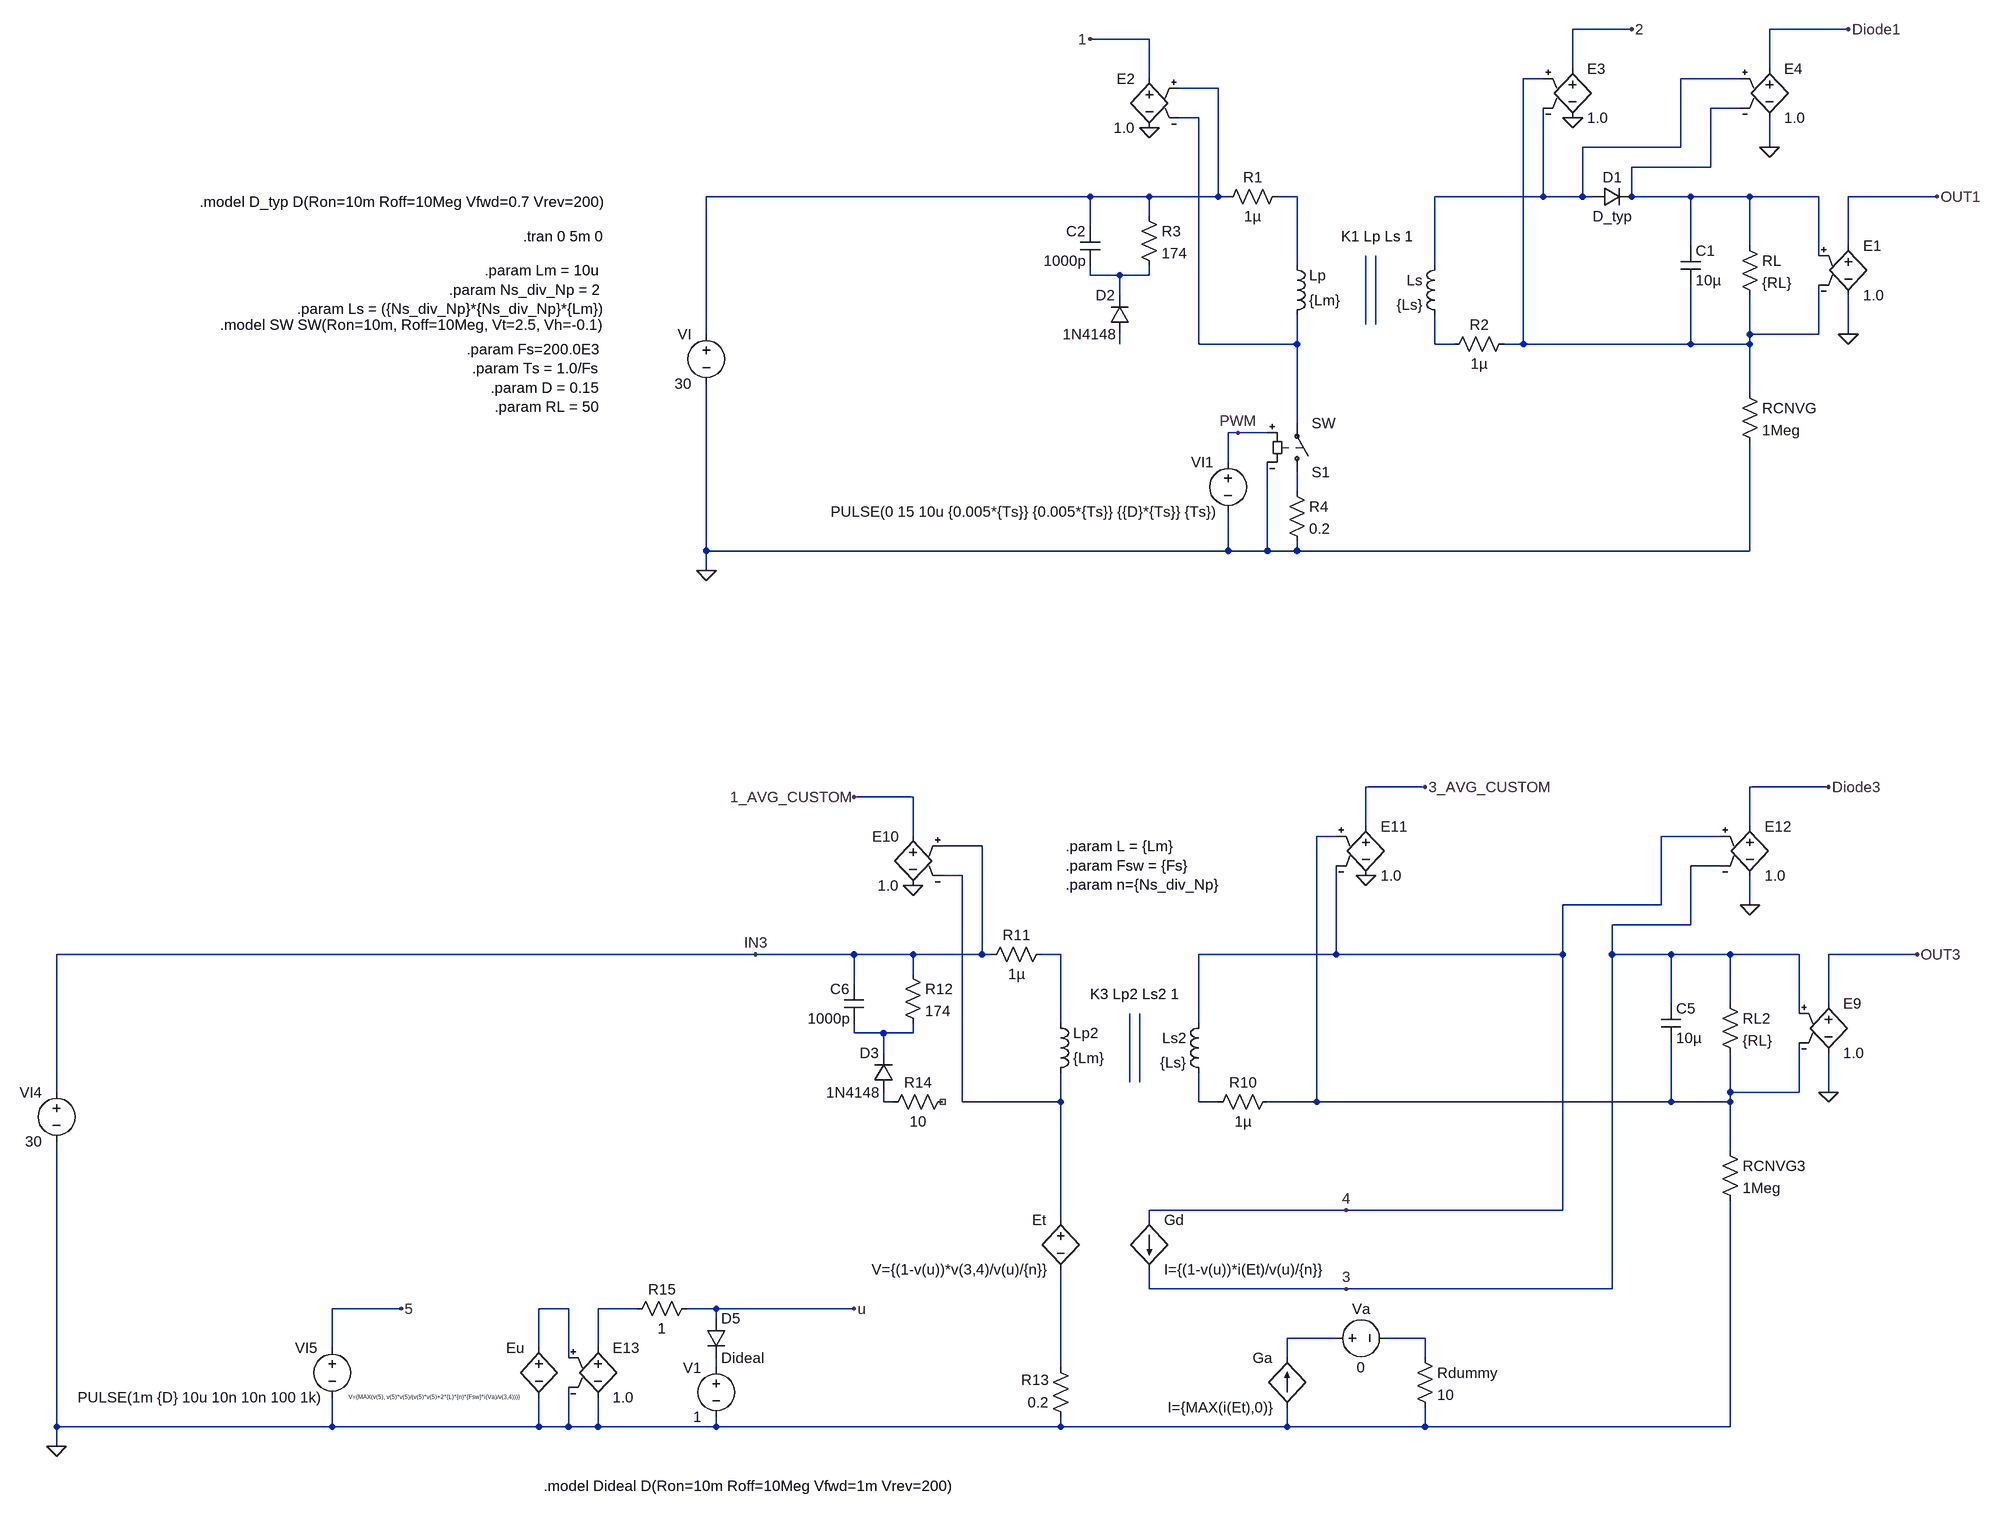
[diagram p0: schematic Flyback_Basic_Model_COPEC_Avgd_PWM_Switch_Diode.asc]
Flyback_Basic_Model_COPEC_Avgd_PWM_Switch_Diode.asc, the LTspice schematic file:
Version 4.1
SHEET 1 1712 3524
WIRE 624 -288 528 -288
WIRE 976 -288 848 -288
WIRE -160 -272 -256 -272
WIRE 528 -224 528 -288
WIRE 848 -224 848 -288
WIRE -160 -208 -160 -272
WIRE 480 -208 448 -208
WIRE 800 -208 704 -208
WIRE -48 -192 -112 -192
WIRE 800 -160 752 -160
WIRE -80 -144 -112 -144
WIRE 704 -96 704 -208
WIRE 704 -96 544 -96
WIRE 848 -96 848 -144
WIRE 752 -64 752 -160
WIRE 752 -64 624 -64
WIRE -256 -16 -880 -16
WIRE -160 -16 -256 -16
WIRE -48 -16 -48 -192
WIRE -48 -16 -160 -16
WIRE -32 -16 -48 -16
WIRE 80 -16 48 -16
WIRE 480 -16 480 -160
WIRE 480 -16 304 -16
WIRE 544 -16 544 -96
WIRE 544 -16 480 -16
WIRE 560 -16 544 -16
WIRE 624 -16 624 -64
WIRE 720 -16 624 -16
WIRE 816 -16 720 -16
WIRE 928 -16 816 -16
WIRE 1120 -16 976 -16
WIRE -160 16 -160 -16
WIRE -256 32 -256 -16
WIRE 720 64 720 -16
WIRE 816 64 816 -16
WIRE 976 64 976 -16
WIRE 928 80 928 -16
WIRE 80 96 80 -16
WIRE 304 96 304 -16
WIRE -256 112 -256 96
WIRE -208 112 -256 112
WIRE -160 112 -160 96
WIRE -160 112 -208 112
WIRE -208 144 -208 112
WIRE -880 208 -880 -16
WIRE 816 208 816 144
WIRE 928 208 928 128
WIRE 928 208 816 208
WIRE 976 208 976 144
WIRE -208 224 -208 208
WIRE -80 224 -80 -144
WIRE 80 224 80 176
WIRE 80 224 -80 224
WIRE 304 224 304 176
WIRE 336 224 304 224
WIRE 448 224 448 -208
WIRE 448 224 416 224
WIRE 720 224 720 128
WIRE 720 224 448 224
WIRE 816 224 816 208
WIRE 816 224 720 224
WIRE 816 304 816 224
WIRE 80 352 80 224
WIRE -16 368 -32 368
WIRE 32 368 -16 368
WIRE -32 416 -32 368
WIRE 80 464 80 432
WIRE -880 560 -880 288
WIRE -32 560 -32 496
WIRE -32 560 -880 560
WIRE 32 560 32 416
WIRE 32 560 -32 560
WIRE 80 560 80 544
WIRE 80 560 32 560
WIRE 816 560 816 384
WIRE 816 560 80 560
WIRE -880 592 -880 560
WIRE 288 944 192 944
WIRE 944 944 816 944
WIRE -544 960 -640 960
WIRE 192 1008 192 944
WIRE 816 1008 816 944
WIRE -544 1024 -544 960
WIRE 144 1024 112 1024
WIRE 768 1024 672 1024
WIRE -432 1040 -496 1040
WIRE 768 1072 720 1072
WIRE -464 1088 -496 1088
WIRE 672 1136 672 1024
WIRE 672 1136 512 1136
WIRE 816 1136 816 1088
WIRE 720 1168 720 1072
WIRE 720 1168 592 1168
WIRE -800 1216 -1936 1216
WIRE -640 1216 -800 1216
WIRE -544 1216 -640 1216
WIRE -432 1216 -432 1040
WIRE -432 1216 -544 1216
WIRE -416 1216 -432 1216
WIRE -304 1216 -336 1216
WIRE 144 1216 144 1072
WIRE 144 1216 -80 1216
WIRE 512 1216 512 1136
WIRE 512 1216 144 1216
WIRE 592 1216 592 1168
WIRE 688 1216 592 1216
WIRE 784 1216 688 1216
WIRE 896 1216 784 1216
WIRE 1088 1216 944 1216
WIRE -544 1248 -544 1216
WIRE -640 1264 -640 1216
WIRE 688 1296 688 1216
WIRE 784 1296 784 1216
WIRE 944 1296 944 1216
WIRE 896 1312 896 1216
WIRE -304 1328 -304 1216
WIRE -80 1328 -80 1216
WIRE -640 1344 -640 1328
WIRE -592 1344 -640 1344
WIRE -544 1344 -544 1328
WIRE -544 1344 -592 1344
WIRE -592 1376 -592 1344
WIRE -1936 1440 -1936 1216
WIRE 784 1440 784 1376
WIRE 896 1440 896 1360
WIRE 896 1440 784 1440
WIRE 944 1440 944 1376
WIRE -592 1456 -592 1440
WIRE -576 1456 -592 1456
WIRE -464 1456 -464 1088
WIRE -304 1456 -304 1408
WIRE -304 1456 -464 1456
WIRE -80 1456 -80 1408
WIRE -48 1456 -80 1456
WIRE 112 1456 112 1024
WIRE 112 1456 32 1456
WIRE 688 1456 688 1360
WIRE 688 1456 112 1456
WIRE 784 1456 784 1440
WIRE 784 1456 688 1456
WIRE 784 1536 784 1456
WIRE 160 1632 -160 1632
WIRE 512 1632 512 1216
WIRE 512 1632 160 1632
WIRE -304 1648 -304 1456
WIRE -160 1648 -160 1632
WIRE -160 1760 -160 1728
WIRE 160 1760 -160 1760
WIRE 592 1760 592 1216
WIRE 592 1760 160 1760
WIRE -1376 1792 -1488 1792
WIRE -1104 1792 -1152 1792
WIRE -992 1792 -1056 1792
WIRE -864 1792 -912 1792
WIRE -640 1792 -864 1792
WIRE -864 1808 -864 1792
WIRE 144 1840 64 1840
WIRE 288 1840 224 1840
WIRE -1488 1856 -1488 1792
WIRE -1152 1856 -1152 1792
WIRE -1056 1856 -1056 1792
WIRE -1104 1872 -1104 1792
WIRE 64 1872 64 1840
WIRE 288 1872 288 1840
WIRE -864 1888 -864 1872
WIRE -304 1888 -304 1728
WIRE -1936 1984 -1936 1520
WIRE -1488 1984 -1488 1936
WIRE -1488 1984 -1936 1984
WIRE -1152 1984 -1152 1936
WIRE -1152 1984 -1488 1984
WIRE -1104 1984 -1104 1920
WIRE -1104 1984 -1152 1984
WIRE -1056 1984 -1056 1936
WIRE -1056 1984 -1104 1984
WIRE -864 1984 -864 1968
WIRE -864 1984 -1056 1984
WIRE -304 1984 -304 1968
WIRE -304 1984 -864 1984
WIRE 64 1984 64 1952
WIRE 64 1984 -304 1984
WIRE 288 1984 288 1952
WIRE 288 1984 64 1984
WIRE 784 1984 784 1616
WIRE 784 1984 288 1984
WIRE -1936 2016 -1936 1984
FLAG -880 592 0
FLAG 976 208 0
FLAG 1120 -16 OUT1
FLAG -160 -128 0
FLAG 528 -144 0
FLAG -256 -272 1
FLAG 624 -288 2
FLAG 848 -96 0
FLAG 976 -288 Diode1
FLAG -16 368 PWM
FLAG -1936 2016 0
FLAG 944 1440 0
FLAG 1088 1216 OUT3
FLAG -544 1104 0
FLAG 192 1088 0
FLAG -640 960 1_AVG_CUSTOM
FLAG 288 944 3_AVG_CUSTOM
FLAG -800 1216 IN3
FLAG 816 1136 0
FLAG 944 944 Diode3
FLAG -1376 1792 5
FLAG -640 1792 u
FLAG 160 1632 4
FLAG 160 1760 3
SYMBOL ind 64 192 M180
WINDOW 0 36 80 Left 2
WINDOW 3 36 40 Left 2
SYMATTR InstName Lp
SYMATTR Value {Lm}
SYMATTR Type ind
SYMBOL ind 320 80 M0
SYMATTR InstName Ls
SYMATTR Value {Ls}
SYMATTR Type ind
SYMBOL voltage -880 192 M0
WINDOW 123 0 0 Left 0
WINDOW 39 0 0 Left 0
SYMATTR InstName VI
SYMATTR Value 30
SYMBOL voltage -32 400 M0
WINDOW 123 0 0 Left 0
WINDOW 39 0 0 Left 0
SYMATTR InstName VI1
SYMATTR Value PULSE(0 15 10u {0.005*{Ts}} {0.005*{Ts}} {{D}*{Ts}} {Ts})
SYMBOL res 800 48 R0
SYMATTR InstName RL
SYMATTR Value {RL}
SYMBOL cap 704 64 R0
SYMATTR InstName C1
SYMATTR Value 10µ
SYMBOL diode 560 0 R270
WINDOW 0 32 32 VTop 2
WINDOW 3 0 32 VBottom 2
SYMATTR InstName D1
SYMATTR Value D_typ
SYMBOL res 800 288 R0
SYMATTR InstName RCNVG
SYMATTR Value 1Meg
SYMBOL e 976 48 R0
SYMATTR InstName E1
SYMATTR Value 1.0
SYMBOL res 432 208 R90
WINDOW 0 0 56 VBottom 2
WINDOW 3 32 56 VTop 2
SYMATTR InstName R2
SYMATTR Value 1µ
SYMBOL res -48 0 R270
WINDOW 0 32 56 VTop 2
WINDOW 3 0 56 VBottom 2
SYMATTR InstName R1
SYMATTR Value 1µ
SYMBOL e -160 -224 M0
SYMATTR InstName E2
SYMATTR Value 1.0
SYMBOL e 528 -240 R0
SYMATTR InstName E3
SYMATTR Value 1.0
SYMBOL sw 80 448 M180
SYMATTR InstName S1
SYMBOL diode -192 208 R180
WINDOW 0 24 64 Left 2
WINDOW 3 24 0 Left 2
SYMATTR InstName D2
SYMATTR Value 1N4148
SYMBOL cap -240 32 M0
SYMATTR InstName C2
SYMATTR Value 1000p
SYMBOL res -176 0 R0
SYMATTR InstName R3
SYMATTR Value 174
SYMBOL res 64 448 R0
SYMATTR InstName R4
SYMATTR Value 0.2
SYMBOL e 848 -240 R0
SYMATTR InstName E4
SYMATTR Value 1.0
SYMBOL ind -320 1424 M180
WINDOW 0 36 80 Left 2
WINDOW 3 36 40 Left 2
SYMATTR InstName Lp2
SYMATTR Value {Lm}
SYMATTR Type ind
SYMBOL ind -64 1312 M0
SYMATTR InstName Ls2
SYMATTR Value {Ls}
SYMATTR Type ind
SYMBOL voltage -1936 1424 M0
WINDOW 123 0 0 Left 0
WINDOW 39 0 0 Left 0
SYMATTR InstName VI4
SYMATTR Value 30
SYMBOL res 768 1280 R0
SYMATTR InstName RL2
SYMATTR Value {RL}
SYMBOL cap 672 1296 R0
SYMATTR InstName C5
SYMATTR Value 10µ
SYMBOL res 768 1520 R0
SYMATTR InstName RCNVG3
SYMATTR Value 1Meg
SYMBOL e 944 1280 R0
SYMATTR InstName E9
SYMATTR Value 1.0
SYMBOL res 48 1440 R90
WINDOW 0 0 56 VBottom 2
WINDOW 3 32 56 VTop 2
SYMATTR InstName R10
SYMATTR Value 1µ
SYMBOL res -432 1232 R270
WINDOW 0 32 56 VTop 2
WINDOW 3 0 56 VBottom 2
SYMATTR InstName R11
SYMATTR Value 1µ
SYMBOL e -544 1008 M0
SYMATTR InstName E10
SYMATTR Value 1.0
SYMBOL e 192 992 R0
SYMATTR InstName E11
SYMATTR Value 1.0
SYMBOL diode -576 1440 R180
WINDOW 0 24 64 Left 2
WINDOW 3 24 0 Left 2
SYMATTR InstName D3
SYMATTR Value 1N4148
SYMBOL cap -624 1264 M0
SYMATTR InstName C6
SYMATTR Value 1000p
SYMBOL res -560 1232 R0
SYMATTR InstName R12
SYMATTR Value 174
SYMBOL e 816 992 R0
SYMATTR InstName E12
SYMATTR Value 1.0
SYMBOL voltage -1488 1840 M0
WINDOW 123 0 0 Left 0
WINDOW 39 0 0 Left 0
SYMATTR InstName VI5
SYMATTR Value PULSE(1m {D} 10u 10n 10n 100 1k)
SYMBOL res -480 1440 R90
WINDOW 0 0 56 VBottom 2
WINDOW 3 32 56 VTop 2
SYMATTR InstName R14
SYMATTR Value 10
SYMBOL res -288 1984 R180
WINDOW 0 36 76 Left 2
WINDOW 3 36 40 Left 2
SYMATTR InstName R13
SYMATTR Value 0.2
SYMBOL bv -1152 1840 M0
WINDOW 3 24 96 Left 0
SYMATTR Value V={MAX(v(5), v(5)*v(5)/(v(5)*v(5)+2*{L}*{n}*{Fsw}*i(Va)/v(3,4)))}
SYMATTR InstName Eu
SYMBOL bv -304 1632 M0
SYMATTR InstName Et
SYMATTR Value V={(1-v(u))*v(3,4)/v(u)/{n}}
SYMBOL bi -160 1648 R0
SYMATTR InstName Gd
SYMATTR Value I={(1-v(u))*i(Et)/v(u)/{n}}
SYMBOL bi 64 1952 R180
WINDOW 0 24 80 Left 2
WINDOW 3 24 0 Left 2
SYMATTR InstName Ga
SYMATTR Value I={MAX(i(Et),0)}
SYMBOL voltage 128 1840 R270
WINDOW 0 32 56 VTop 2
WINDOW 3 -32 56 VBottom 2
WINDOW 123 0 0 Left 0
WINDOW 39 0 0 Left 0
SYMATTR InstName Va
SYMATTR Value 0
SYMBOL res 272 1856 R0
SYMATTR InstName Rdummy
SYMATTR Value 10
SYMBOL e -1056 1840 R0
SYMATTR InstName E13
SYMATTR Value 1.0
SYMBOL res -896 1776 R90
WINDOW 0 0 56 VBottom 2
WINDOW 3 32 56 VTop 2
SYMATTR InstName R15
SYMATTR Value 1
SYMBOL diode -880 1808 R0
SYMATTR InstName D5
SYMATTR Value Dideal
SYMBOL voltage -864 1872 M0
WINDOW 123 0 0 Left 0
WINDOW 39 0 0 Left 0
SYMATTR InstName V1
SYMATTR Value 1
TEXT 152 48 Left 2 !K1 Lp Ls 1
TEXT -1048 48 Right 2 !.tran 0 5m 0
TEXT -1056 192 Right 2 !.model SW SW(Ron=10m, Roff=10Meg, Vt=2.5, Vh=-0.1)
TEXT -1056 232 Right 2 !.param Fs=200.0E3\n.param Ts = 1.0/Fs\n.param D = 0.15\n.param RL = 50
TEXT -1056 -8 Right 2 !.model D_typ D(Ron=10m Roff=10Meg Vfwd=0.7 Vrev=200)
TEXT -1056 104 Right 2 !.param Lm = 10u\n.param Ns_div_Np = 2\n.param Ls = ({Ns_div_Np}*{Ns_div_Np}*{Lm})
TEXT -256 1280 Left 2 !K3 Lp2 Ls2 1
TEXT -296 1040 Left 2 !.param L = {Lm}\n.param Fsw = {Fs}\n.param n={Ns_div_Np}
TEXT -1144 2080 Left 2 !.model Dideal D(Ron=10m Roff=10Meg Vfwd=1m Vrev=200)
LINE Normal 192 192 192 80
LINE Normal 208 192 208 80
LINE Normal -192 1424 -192 1312
LINE Normal -176 1424 -176 1312

The netlist it stands for:
* Flyback_Basic_Model_COPEC_Avgd_PWM_Switch_Diode.asc
Lp N005 N006 {Lm}
Ls N002 N009 {Ls}
VI N003 0 30
VI1 PWM 0 PULSE(0 15 10u {0.005*{Ts}} {0.005*{Ts}} {{D}*{Ts}} {Ts})
RL N004 N001 {RL}
C1 N004 N001 10µ
D1 N002 N004 D_typ
RCNVG N001 0 1Meg
E1 OUT1 0 N004 N001 1.0
R2 N001 N009 1µ
R1 N003 N006 1µ
E2 1 0 N003 N005 1.0
E3 2 0 N001 N002 1.0
S1 N010 N005 PWM 0 SW
D2 N008 N007 1N4148
C2 N003 N007 1000p
R3 N003 N007 174
R4 N010 0 0.2
E4 Diode1 0 N002 N004 1.0
Lp2 N012 N013 {Lm}
Ls2 4 N016 {Ls}
VI4 IN3 0 30
RL2 3 N011 {RL}
C5 3 N011 10µ
RCNVG3 N011 0 1Meg
E9 OUT3 0 3 N011 1.0
R10 N011 N016 1µ
R11 IN3 N013 1µ
E10 1_AVG_CUSTOM 0 IN3 N012 1.0
E11 3_AVG_CUSTOM 0 N011 4 1.0
D3 N015 N014 1N4148
C6 IN3 N014 1000p
R12 IN3 N014 174
E12 Diode3 0 4 3 1.0
VI5 5 0 PULSE(1m {D} 10u 10n 10n 100 1k)
R14 NC_01 N015 10
R13 0 N022 0.2
B§Eu N017 0 V={MAX(v(5), v(5)*v(5)/(v(5)*v(5)+2*{L}*{n}*{Fsw}*i(Va)/v(3,4)))}
B§Et N012 N022 V={(1-v(u))*v(3,4)/v(u)/{n}}
B§Gd 4 3 I={(1-v(u))*i(Et)/v(u)/{n}}
B§Ga 0 N019 I={MAX(i(Et),0)}
Va N019 N020 0
Rdummy N020 0 10
E13 N018 0 N017 0 1.0
R15 u N018 1
D5 u N021 Dideal
V1 N021 0 1
.model D D
.lib standard.dio
K1 Lp Ls 1
.tran 0 5m 0
.model SW SW(Ron=10m, Roff=10Meg, Vt=2.5, Vh=-0.1)
.param Fs=200.0E3
.param Ts = 1.0/Fs
.param D = 0.15
.param RL = 50
.model D_typ D(Ron=10m Roff=10Meg Vfwd=0.7 Vrev=200)
.param Lm = 10u
.param Ns_div_Np = 2
.param Ls = ({Ns_div_Np}*{Ns_div_Np}*{Lm})
K3 Lp2 Ls2 1
.param L = {Lm}
.param Fsw = {Fs}
.param n={Ns_div_Np}
.model Dideal D(Ron=10m Roff=10Meg Vfwd=1m Vrev=200)
.backanno
.end